# Altium schematic sheet controller.SchDoc
size A4
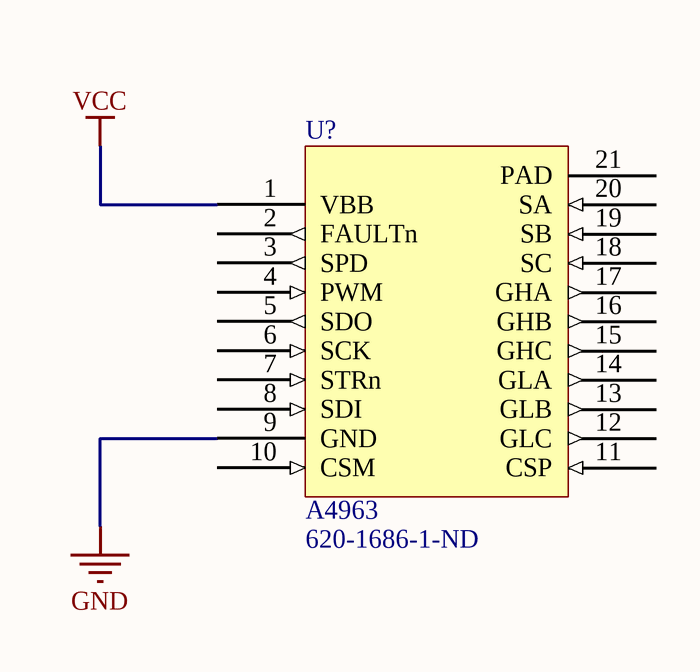
[diagram p0: controller.SchDoc]

## Parts
U?  A4963  Supplier Part Number 1: 620-1686-1-ND  [TSOP65P640X120_HS-21M]

## Nets
GND: U?.9(GND)
VCC: U?.1(VBB)

Not connected (* = marked no-connect by the designer): U? 2(FAULTn) 3(SPD) 4(PWM) 5(SDO) 6(SCK) 7(STRn) 8(SDI) 10(CSM) 11(CSP) 12(GLC) 13(GLB) 14(GLA) 15(GHC) 16(GHB) 17(GHA) 18(SC) 19(SB) 20(SA) 21(PAD)

## Library data of the parts
U? = A4963, BLDC, 3Phase: A4963, BLDC, 3 Phase, Sensorless; Supplier 1: Digi-Key; Created By: Poorna Chander Kalidas